# EAGLE design backplane (EAGLE 9.6.2)
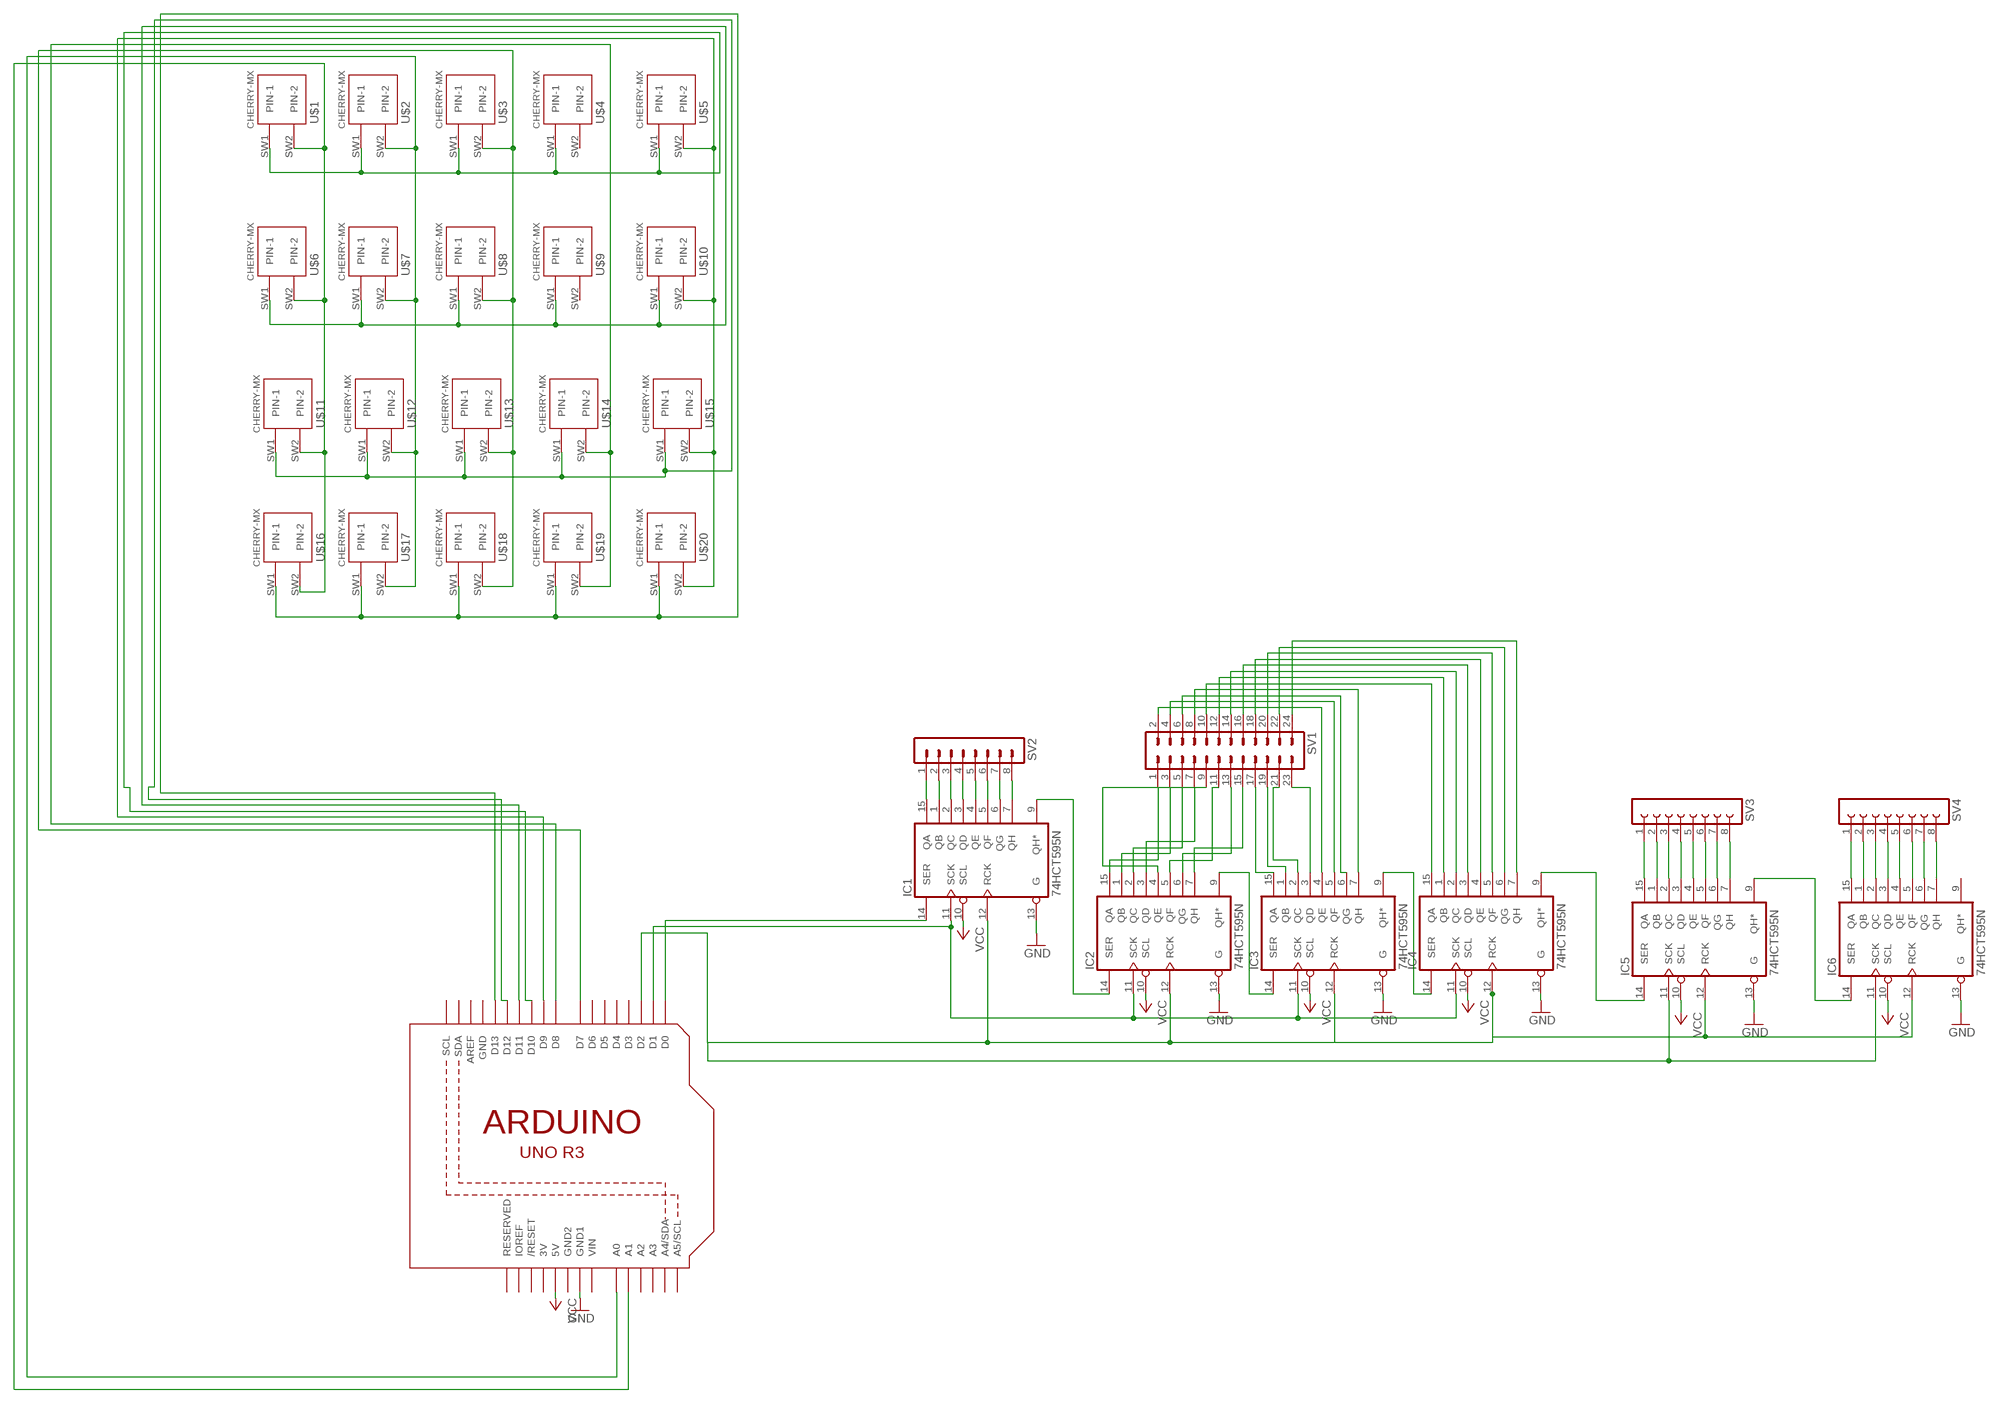
[diagram p0: schematic, sheet 1]

## Parts
IC1  74HCT595N  [DIL16]
IC2  74HCT595N  [DIL16]
IC3  74HCT595N  [DIL16]
IC4  74HCT595N  [DIL16]
IC5  74HCT595N  [DIL16]
IC6  74HCT595N  [DIL16]
SV1  MA12-2  [MA12-2]
SV2  MA08-1  [MA08-1]
SV3  FE08-1  [FE08]
SV4  FE08-1  [FE08]
U1  ARDUINOR3-BPLACE  [ARDUINOR3-BPLACE]
U$1  CHERRY-MX  [CHERRY-MX]
U$2  CHERRY-MX  [CHERRY-MX]
U$3  CHERRY-MX  [CHERRY-MX]
U$4  CHERRY-MX  [CHERRY-MX]
U$5  CHERRY-MX  [CHERRY-MX]
U$6  CHERRY-MX  [CHERRY-MX]
U$7  CHERRY-MX  [CHERRY-MX]
U$8  CHERRY-MX  [CHERRY-MX]
U$9  CHERRY-MX  [CHERRY-MX]
U$10  CHERRY-MX  [CHERRY-MX]
U$11  CHERRY-MX  [CHERRY-MX]
U$12  CHERRY-MX  [CHERRY-MX]
U$13  CHERRY-MX  [CHERRY-MX]
U$14  CHERRY-MX  [CHERRY-MX]
U$15  CHERRY-MX  [CHERRY-MX]
U$16  CHERRY-MX  [CHERRY-MX]
U$17  CHERRY-MX  [CHERRY-MX]
U$18  CHERRY-MX  [CHERRY-MX]
U$19  CHERRY-MX  [CHERRY-MX]
U$20  CHERRY-MX  [CHERRY-MX]

## Nets
GND: IC1.13(G) IC2.13(G) IC3.13(G) IC4.13(G) IC5.13(G) IC6.13(G) U1.GND1
N$1: U1.D10 U$1.SW1(PIN-1) U$2.SW1(PIN-1) U$3.SW1(PIN-1) U$4.SW1(PIN-1) U$5.SW1(PIN-1)
N$2: U1.D11 U$6.SW1(PIN-1) U$7.SW1(PIN-1) U$8.SW1(PIN-1) U$9.SW1(PIN-1) U$10.SW1(PIN-1)
N$3: U1.D12 U$11.SW1(PIN-1) U$12.SW1(PIN-1) U$13.SW1(PIN-1) U$14.SW1(PIN-1) U$15.SW1(PIN-1)
N$4: U1.A1 U$1.SW2(PIN-2) U$6.SW2(PIN-2) U$11.SW2(PIN-2) U$16.SW2(PIN-2)
N$5: U1.A0 U$2.SW2(PIN-2) U$7.SW2(PIN-2) U$12.SW2(PIN-2) U$17.SW2(PIN-2)
N$6: U1.D7 U$3.SW2(PIN-2) U$8.SW2(PIN-2) U$13.SW2(PIN-2) U$18.SW2(PIN-2)
N$7: U1.D8 U$14.SW2(PIN-2) U$19.SW2(PIN-2)
N$8: U1.D9 U$5.SW2(PIN-2) U$10.SW2(PIN-2) U$15.SW2(PIN-2) U$20.SW2(PIN-2)
N$9: IC3.5(QF) SV1.4
N$10: U1.D13 U$16.SW1(PIN-1) U$17.SW1(PIN-1) U$18.SW1(PIN-1) U$19.SW1(PIN-1) U$20.SW1(PIN-1)
N$11: IC3.6(QG) SV1.6
N$12: IC3.7(QH) SV1.8
N$13: IC2.15(QA) SV1.1
N$14: IC2.1(QB) SV1.3
N$15: IC2.2(QC) SV1.5
N$16: IC2.3(QD) SV1.7
N$17: IC2.4(QE) SV1.9
N$18: IC2.5(QF) SV1.11
N$19: IC2.6(QG) SV1.13
N$20: IC2.7(QH) SV1.15
N$21: IC3.15(QA) SV1.17
N$22: IC3.1(QB) SV1.19
N$23: IC3.2(QC) SV1.21
N$24: IC3.3(QD) SV1.23
N$25: IC3.4(QE) SV1.2
N$26: IC4.15(QA) SV1.10
N$27: IC4.1(QB) SV1.12
N$28: IC4.2(QC) SV1.14
N$29: IC4.3(QD) SV1.16
N$30: IC4.4(QE) SV1.18
N$31: IC4.5(QF) SV1.20
N$32: IC4.6(QG) SV1.22
N$33: IC4.7(QH) SV1.24
N$34: IC1.15(QA) SV2.1
N$35: IC1.1(QB) SV2.2
N$36: IC1.2(QC) SV2.3
N$37: IC1.3(QD) SV2.4
N$38: IC1.4(QE) SV2.5
N$39: IC1.5(QF) SV2.6
N$40: IC1.6(QG) SV2.7
N$41: IC1.7(QH) SV2.8
N$42: IC1.9(QH*) IC2.14(SER)
N$43: IC2.9(QH*) IC3.14(SER)
N$44: IC3.9(QH*) IC4.14(SER)
N$45: IC1.14(SER) U1.D0
N$46: IC1.11(SCK) IC2.11(SCK) IC3.11(SCK) IC4.11(SCK) U1.D1
N$47: IC5.15(QA) SV3.1
N$48: IC1.12(RCK) IC2.12(RCK) IC3.12(RCK) IC4.12(RCK) IC5.11(SCK) IC5.12(RCK) IC6.11(SCK) IC6.12(RCK) U1.D2
N$49: IC5.1(QB) SV3.2
N$50: IC5.2(QC) SV3.3
N$51: IC5.3(QD) SV3.4
N$52: IC5.4(QE) SV3.5
N$53: IC5.5(QF) SV3.6
N$54: IC5.6(QG) SV3.7
N$55: IC5.7(QH) SV3.8
N$56: IC6.15(QA) SV4.1
N$57: IC6.1(QB) SV4.2
N$58: IC6.2(QC) SV4.3
N$59: IC6.3(QD) SV4.4
N$60: IC6.4(QE) SV4.5
N$61: IC6.5(QF) SV4.6
N$62: IC6.6(QG) SV4.7
N$63: IC6.7(QH) SV4.8
N$64: IC5.9(QH*) IC6.14(SER)
N$65: IC4.9(QH*) IC5.14(SER)
VCC: IC1.10(SCL) IC2.10(SCL) IC3.10(SCL) IC4.10(SCL) IC5.10(SCL) IC6.10(SCL) U1.5V
Unconnected: IC6.9(QH*) U1.A2 U1.A3 U1.A4(A4/SDA) U1.A5(A5/SCL) U1.AREF U1.D3 U1.D4 U1.D5 U1.D6 U1.IOREF U1.RESERVED U1.RESET(/RESET) U1.SCL U1.SDA U$4.SW2(PIN-2) U$9.SW2(PIN-2)

## Power pins joined to a net without a drawn wire
3V: U1.3V
GND: IC1.8(GND) IC2.8(GND) IC3.8(GND) IC4.8(GND) IC5.8(GND) IC6.8(GND) U1.GND
GND2: U1.GND2
VCC: IC1.16(VCC) IC2.16(VCC) IC3.16(VCC) IC4.16(VCC) IC5.16(VCC) IC6.16(VCC)
VIN: U1.VIN

## Library data of the parts
IC1-IC6 = 74xx-eu:74*595: 8-bit SHIFT REGISTER, output latch
SV1 = con-lstb:MA12-2: PIN HEADER; OC_FARNELL: unknown; OC_NEWARK: unknown
SV2 = con-lstb:MA08-1: PIN HEADER; OC_FARNELL: unknown; OC_NEWARK: unknown
SV3 SV4 = con-lsta:FE08-1: FEMALE HEADER; OC_FARNELL: unknown; OC_NEWARK: unknown
U1 = adafruit:ARDUINOR3: This is a new object for the new Arduino R3 - with extra pins that you may want to use (such as IOref, and duplicated A4/A5
U$1-U$20 = cherrymx:CHERRY-MX: Cherry MX series keyswitch

## Board
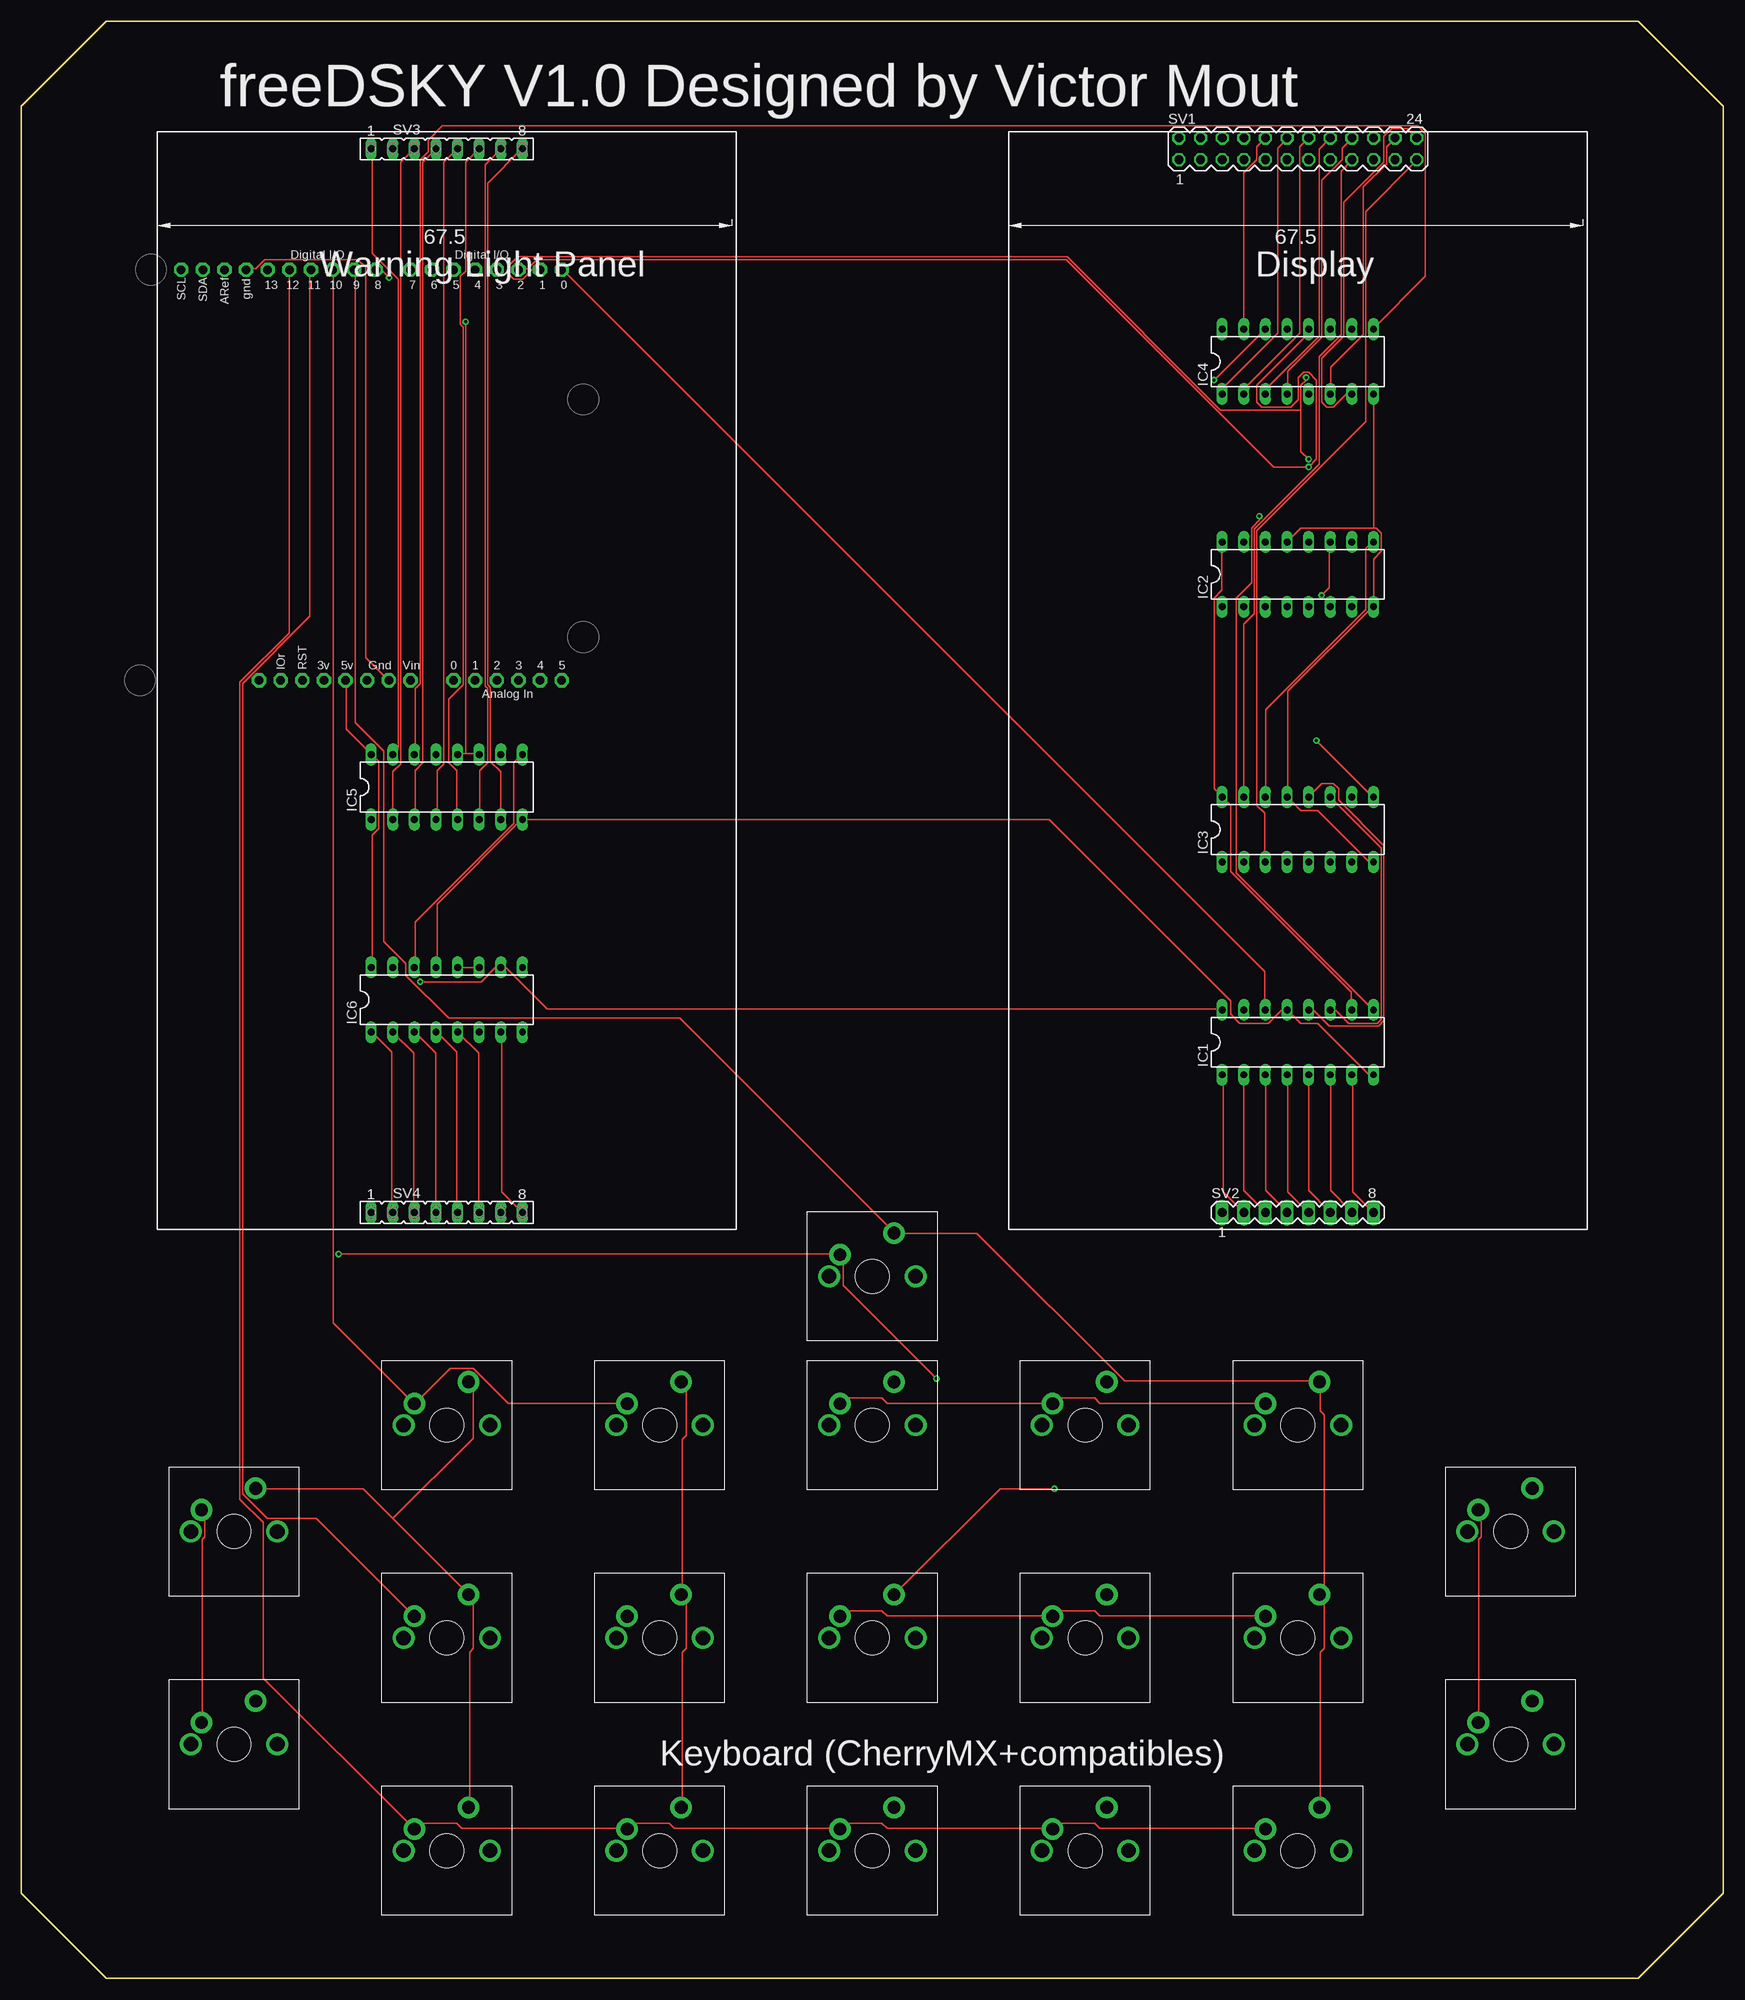
[diagram p1: board, top side]
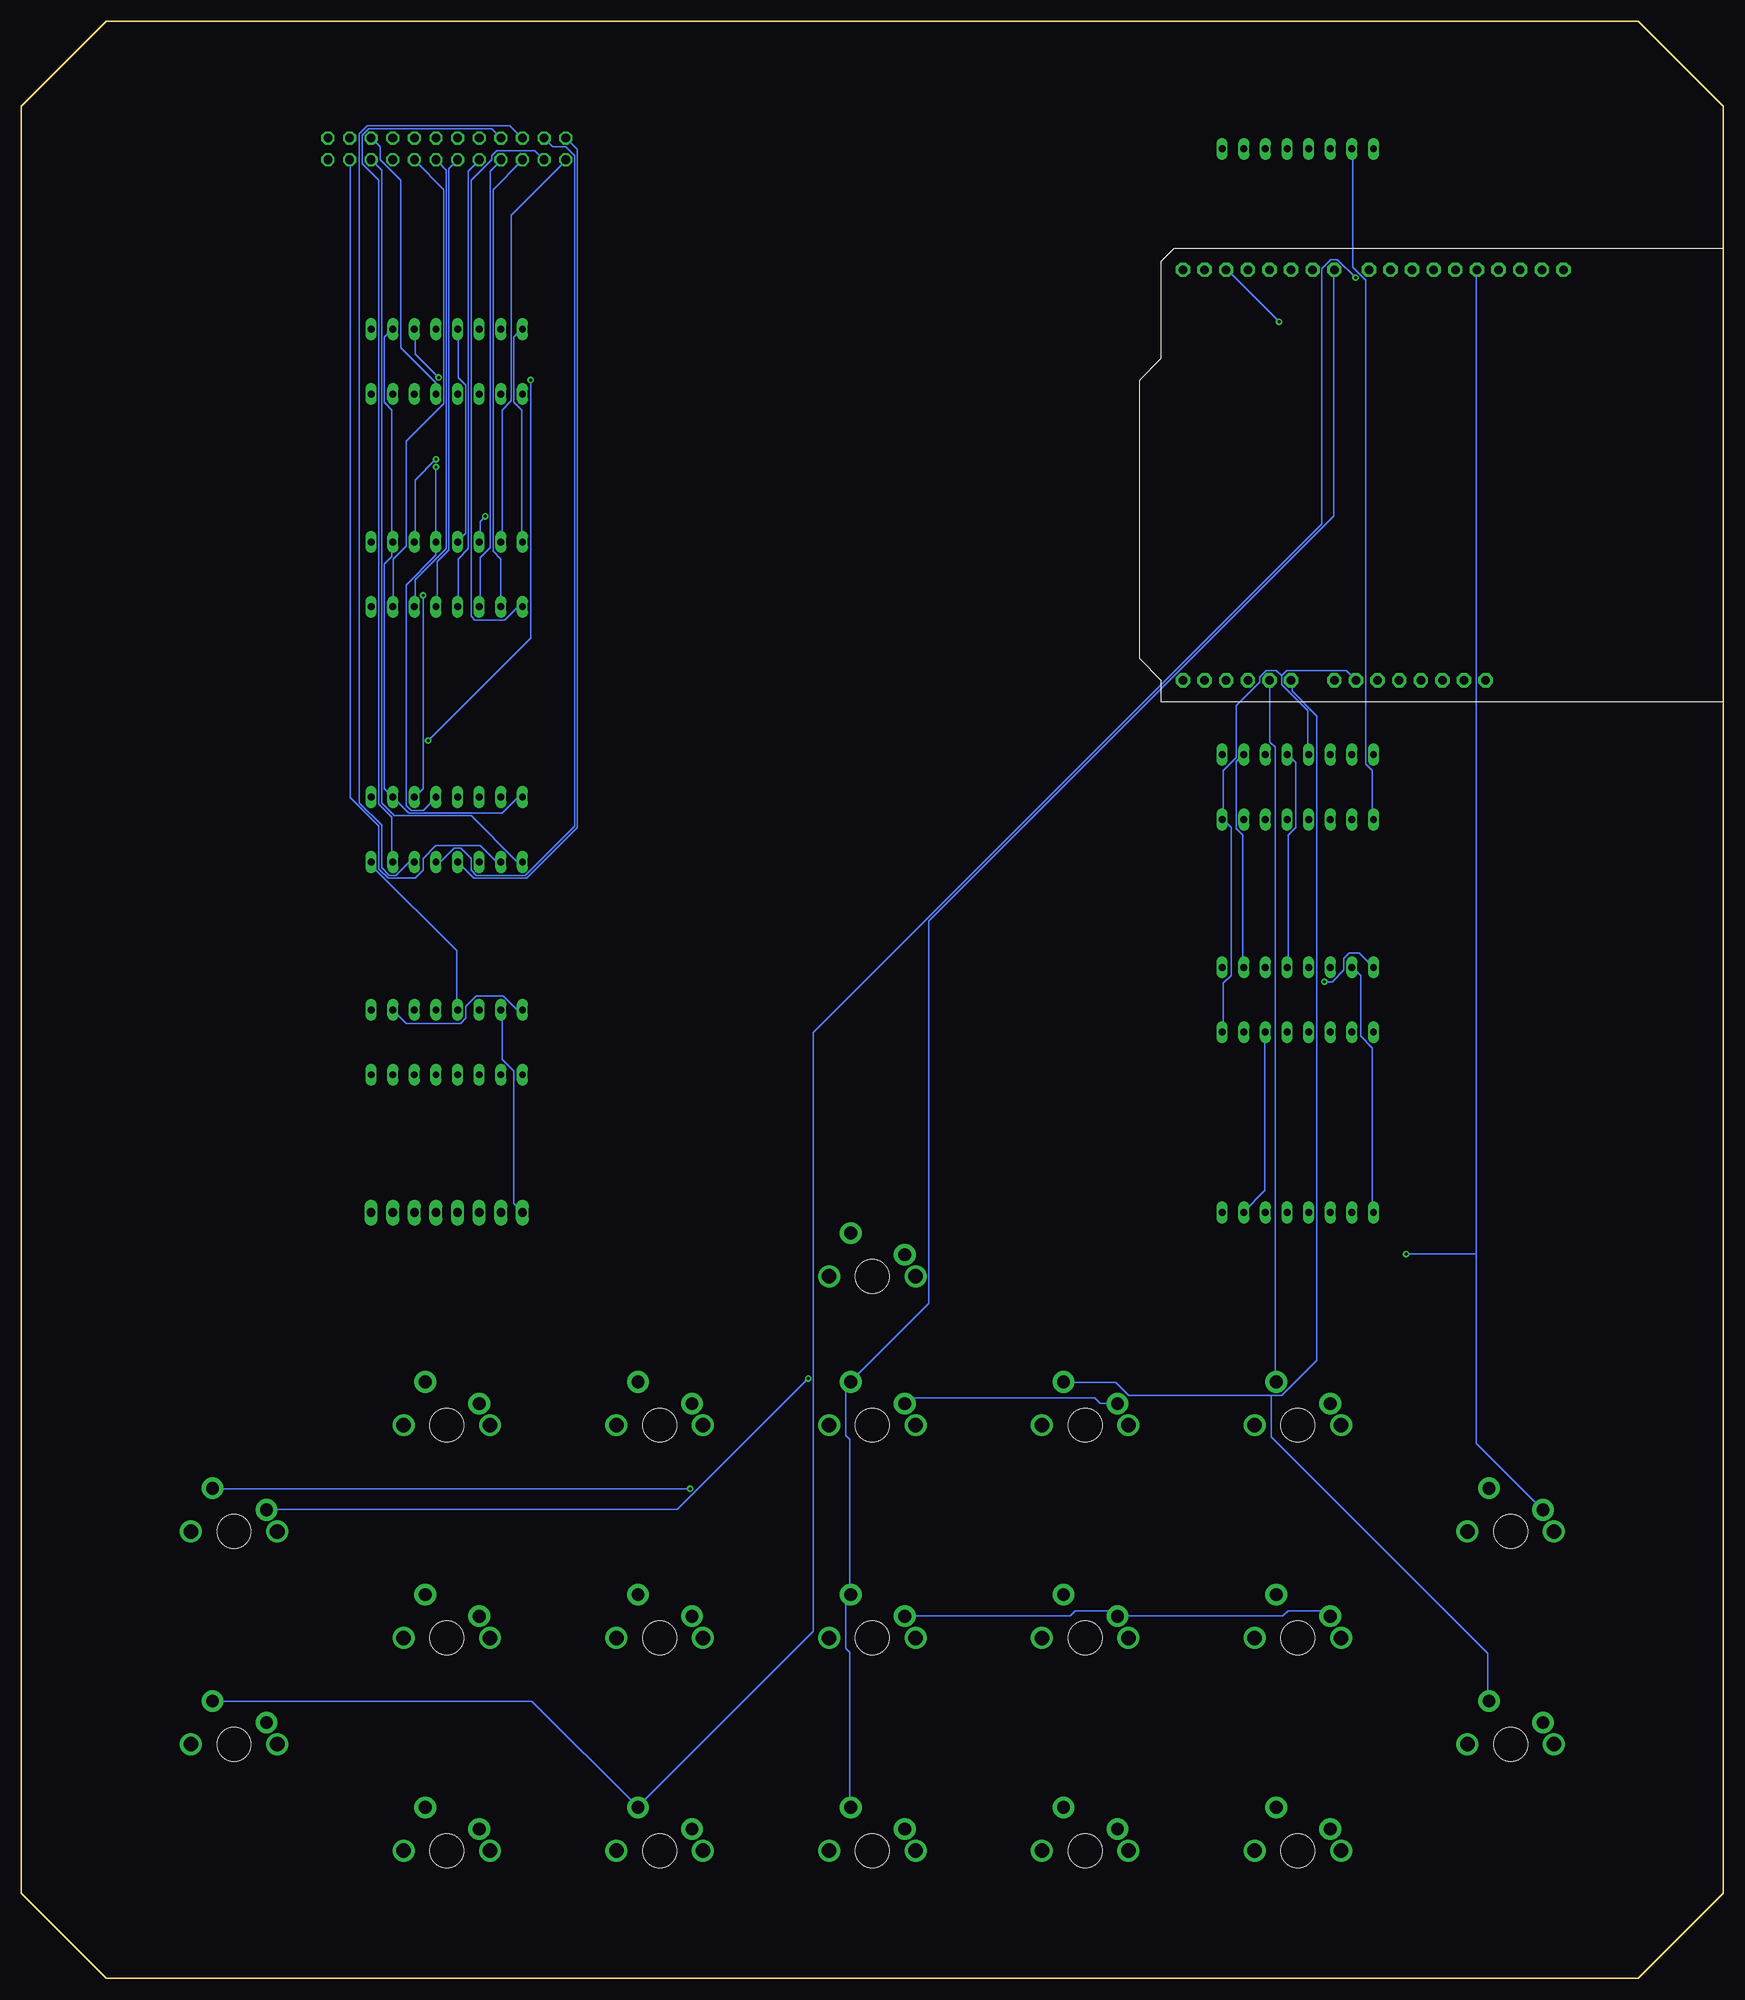
[diagram p2: board, bottom side, seen from below]

Size 200 x 230 mm. Coordinates in mm from the lower left corner, seen from the top.
Outline: 10,0 190,0 200,10 200,220 190,230 10,230 0,220 0,10 10,0
Copper layers (1*16): Top 0.035mm / dielectric 1.5mm / Bottom 0.035mm
Design rules "default": minimum track width 6mil, minimum drill 0.35mm, track to track 6mil, track to pad 6mil, pad to pad 6mil, via to via 6mil, smd to smd 6mil, copper to edge 40mil, drill to drill 6mil, minimum pad ring 10mil, minimum via ring 8mil, stop-mask expansion 4mil, vias tented up to drill 0mil, thermal gap 10mil

### Footprints (pad centres in the part's own frame; a part is rotated, then mirrored left to right if it is on the bottom)
DIL16 = drill 0.813 long: 1 -8.89,-3.81; 2 -6.35,-3.81; 3 -3.81,-3.81; 4 -1.27,-3.81; 5 1.27,-3.81; 6 3.81,-3.81; 7 6.35,-3.81; 8 8.89,-3.81; 9 8.89,3.81; 10 6.35,3.81; 11 3.81,3.81; 12 1.27,3.81; 13 -1.27,3.81; 14 -3.81,3.81; 15 -6.35,3.81; 16 -8.89,3.81
MA12-2 = drill 1.016 octagon: 1 -13.97,-1.27; 2 -13.97,1.27; 3 -11.43,-1.27; 4 -11.43,1.27; 5 -8.89,-1.27; 6 -8.89,1.27; 7 -6.35,-1.27; 8 -6.35,1.27; 9 -3.81,-1.27; 10 -3.81,1.27; 11 -1.27,-1.27; 12 -1.27,1.27; 13 1.27,-1.27; 14 1.27,1.27; 15 3.81,-1.27; 16 3.81,1.27; 17 6.35,-1.27; 18 6.35,1.27; 19 8.89,-1.27; 20 8.89,1.27; 21 11.43,-1.27; 22 11.43,1.27; 23 13.97,-1.27; 24 13.97,1.27
MA08-1 = drill 1.016 long: 1 -8.89,0; 2 -6.35,0; 3 -3.81,0; 4 -1.27,0; 5 1.27,0; 6 3.81,0; 7 6.35,0; 8 8.89,0
FE08 = drill 0.813 long: 1 -8.89,0; 2 -6.35,0; 3 -3.81,0; 4 -1.27,0; 5 1.27,0; 6 3.81,0; 7 6.35,0; 8 8.89,0
ARDUINOR3-BPLACE = drill 1 pad 1.676 octagon: 3V 35.56,2.54; 5V 38.1,2.54; A0 50.8,2.54; A1 53.34,2.54; A2 55.88,2.54; A3 58.42,2.54; A4 60.96,2.54; A5 63.5,2.54; AREF 23.876,50.8; D0 63.5,50.8; D1 60.96,50.8; D2 58.42,50.8; D3 55.88,50.8; D4 53.34,50.8; D5 50.8,50.8; D6 48.26,50.8; D7 45.72,50.8; D8 41.656,50.8; D9 39.116,50.8; D10 36.576,50.8; D11 34.036,50.8; D12 31.496,50.8; D13 28.956,50.8; GND 26.416,50.8; GND1 43.18,2.54; GND2 40.64,2.54; IOREF 30.48,2.54; RESERVED 27.94,2.54; RESET 33.02,2.54; SCL 18.796,50.8; SDA 21.336,50.8; VIN 45.72,2.54
CHERRY-MX = drill 1.714 pad 1.93: P$3 -5.08,0; P$4 5.08,0 | drill 1.5 pad 2.54: SW1 -3.81,2.54; SW2 2.54,5.08 | hole 4: 0,0

### Placement (x,y rotation side)
IC1  150,110 0 top
IC2  150,165 0 top
IC3  150,135 0 top
IC4  150,190 0 top
IC5  50,140 0 top
IC6  50,115 0 top
SV1  150,215 0 top
SV2  150,90 0 top
SV3  50,215 0 top
SV4  50,90 0 top
U1  0,150 0 top
U$1  50,65 0 top
U$2  75,65 0 top
U$3  100,65 0 top
U$4  125,65 0 top
U$5  150,65 0 top
U$6  50,40 0 top
U$7  75,40 0 top
U$8  100,40 0 top
U$9  125,40 0 top
U$10  150,40 0 top
U$11  50,15 0 top
U$12  75,15 0 top
U$13  100,15 0 top
U$14  125,15 0 top
U$15  150,15 0 top
U$16  25,52.5 0 top
U$17  25,27.5 0 top
U$18  175,52.5 0 top
U$19  175,27.5 0 top
U$20  100,82.5 0 top

### Tracks (layer width: path | path; a pad name or v marks a point on that pad's centre or on a via)
GND
  Top 0.152: IC1.8 158.74,106.29 158.28,106.29 152.34,112.24 150.36,112.24 148.83,113.76 IC1.13 148.68,113.76 148.07,113.76 146.55,112.24 143.19,112.24 142.13,113.3 142.13,114.83 120.79,136.16 58.92,136.16 IC5.8 58.76,136.16 48.86,126.26 48.86,118.94 IC6.13 | IC3.8 158.74,131.29 158.28,131.29 152.34,137.23 150.36,137.23 148.83,138.75 IC3.13 148.83,138.91 148.83,151.25 158.74,161.16 IC2.8 158.89,161.31 158.89,166.8 159.81,167.71 159.81,169.84 159.2,170.45 158.89,170.45 | 158.89,170.45 150.36,170.45 148.83,168.93 IC2.13 | 158.89,170.45 158.89,186.15 IC4.8 | U1.GND 26.46,200.93 27.52,200.93 28.59,202 39.56,202 40.48,201.09 40.48,155.21 43.07,152.62 U1.GND1
  Bottom 0.152: IC1.13 148.83,113.91 148.83,120.77 158.74,130.68 158.74,131.13 IC3.8 | IC4.13 148.68,193.77 148.68,188.13 147.77,187.22 147.77,169.84 148.68,168.93 IC2.13 | IC6.8 58.76,111.32 58.76,116.96 57.85,117.88 57.85,135.25 58.76,136.16 IC5.8 58.76,136.32 58.76,141.96 57.24,143.48 57.24,149.58 54.5,152.32 54.5,152.93 53.73,153.69 52.52,153.69 51.91,153.08 | 51.91,153.08 51.91,152.01 48.86,148.97 48.86,143.94 IC5.13 | 51.91,153.08 51.3,153.69 44.29,153.69 43.22,152.62 U1.GND1
N$1
  Top 0.152: U$3.SW1 96.25,67.58 96.86,68.19 101.13,68.19 101.74,67.58 121.1,67.58 U$4.SW1 121.25,67.58 121.86,68.19 126.12,68.19 126.73,67.58 146.09,67.58 U$5.SW1 | U1.D10 36.67,200.78 36.67,77.03 46.11,67.58 U$1.SW1 46.27,67.58 50.38,71.7 53.13,71.7 57.24,67.58 71.11,67.58 U$2.SW1
  Bottom 0.152: U$2.SW1 71.26,67.58 73.24,67.58 73.85,68.19 95.49,68.19 96.1,67.58 U$3.SW1
N$2
  Top 0.152: U1.D11 33.92,200.78 33.92,160.09 26,152.17 26,56.92 28.89,54.02 34.69,54.02 46.11,42.59 U$6.SW1 | U$8.SW1 96.25,42.59 96.86,43.2 101.13,43.2 101.74,42.59 121.1,42.59 U$9.SW1 121.25,42.59 121.86,43.2 126.12,43.2 126.73,42.59 146.09,42.59 U$10.SW1
  Bottom 0.152: U$6.SW1 46.27,42.59 46.88,43.2 51.14,43.2 51.75,42.59 71.11,42.59 U$7.SW1 71.26,42.59 71.87,43.2 76.14,43.2 76.75,42.59 96.1,42.59 U$8.SW1
N$3
  Top 0.152: U1.D12 31.48,200.78 31.48,158.11 25.69,152.32 25.69,56.31 28.44,53.56 28.44,35.28 46.11,17.6 U$11.SW1 46.27,17.6 46.88,18.21 51.14,18.21 51.75,17.6 71.11,17.6 U$12.SW1 71.26,17.6 71.87,18.21 76.14,18.21 76.75,17.6 96.1,17.6 U$13.SW1 96.25,17.6 96.86,18.21 101.13,18.21 101.74,17.6 121.1,17.6 U$14.SW1 121.25,17.6 121.86,18.21 126.12,18.21 126.73,17.6 146.09,17.6 U$15.SW1
N$4
  Top 0.152: U$11.SW2 52.67,20.19 52.67,38.32 53.13,38.78 53.13,44.57 52.67,45.03 U$6.SW2 52.52,45.18 43.68,54.02 | 43.68,54.02 40.17,57.53 27.67,57.53 U$16.SW2 | 43.68,54.02 53.13,63.47 53.13,69.57 52.67,70.02 U$1.SW2
  Bottom 0.152: U1.A1 53.28,152.47 53.28,145.31 52.67,144.7 52.67,70.17 U$1.SW2
N$5
  Top 0.152: U$12.SW2 77.66,20.19 77.66,38.32 78.12,38.78 78.12,44.57 77.66,45.03 U$7.SW2 77.66,45.18 77.66,63.32 78.12,63.77 78.12,69.57 77.66,70.02 U$2.SW2
  Bottom 0.152: 53.13,68.5 69.89,68.5 71.41,70.02 77.51,70.02 U$2.SW2 | 53.13,68.5 51.91,68.5 47.79,72.61 47.79,148.36 50.69,151.25 50.69,152.47 U1.A0 | 53.13,68.5 53.13,63.62 27.67,38.17 27.67,32.69 U$17.SW2
N$6  (via drill 0.35)
  Top 0.152: v121.4,57.53 115,57.53 102.66,45.18 U$8.SW2
  Bottom 0.152: U$13.SW2 102.66,20.19 102.66,38.32 103.11,38.78 103.11,44.57 102.66,45.03 U$8.SW2 102.66,45.18 102.66,63.32 103.11,63.77 103.11,69.57 102.66,70.02 U$3.SW2 102.5,70.17 93.36,79.32 93.36,124.28 45.81,171.83 45.81,200.78 U1.D7 | v121.4,57.53 177.48,57.53 U$18.SW2
N$7  (via drill 0.35)
  Top 0.152: v43.22,199.87 42.31,200.78 41.7,200.78 U1.D8
  Bottom 0.152: v43.22,199.87 45.35,202 46.11,202 47.18,200.93 47.18,170.91 106.92,111.17 106.92,40.76 127.5,20.19 U$14.SW2 127.65,20.19 139.99,32.53 177.48,32.53 U$19.SW2
N$8
  Top 0.152: U$15.SW2 152.64,20.19 152.64,38.32 153.1,38.78 153.1,44.57 152.64,45.03 U$10.SW2 152.64,45.18 153.1,45.64 153.1,66.21 152.64,66.67 152.64,70.02 U$5.SW2 152.49,70.17 129.63,70.17 112.26,87.55 102.66,87.55 U$20.SW2 102.5,87.7 77.36,112.85 50.23,112.85 45.2,117.88 45.2,119.25 42.61,121.84 42.61,144.24 39.26,147.59 39.26,200.78 U1.D9
N$9
  Bottom 0.152: IC3.5 151.12,131.29 150.66,131.29 149.14,132.81 148.38,132.81 147.16,131.59 147.16,130.22 146.55,129.61 140.76,129.61 134.96,135.4 134.96,214.19 136.03,215.26 137.56,215.26 138.47,216.17 SV1.4
N$10  (via drill 0.35)
  Top 0.152: U$19.SW1 171.24,30.09 171.24,51.58 171.54,51.89 171.54,54.63 171.24,54.94 U$18.SW1 | U$17.SW1 21.27,30.09 21.27,51.58 21.58,51.89 21.58,54.63 21.27,54.94 U$16.SW1 | v37.28,85.11 96.1,85.11 U$20.SW1 96.25,84.96 96.56,84.65 96.56,81.45 v107.53,70.48
  Bottom 0.152: 29.05,85.11 29.05,62.86 21.27,55.09 U$16.SW1 | 29.05,85.11 29.05,200.78 U1.D13 | 29.05,85.11 v37.28,85.11 | v107.53,70.48 122.92,55.09 171.08,55.09 U$18.SW1
N$11
  Bottom 0.152: IC3.6 153.86,131.13 154.47,131.13 156,129.61 156.76,129.61 157.67,130.53 157.67,135.56 160.26,138.15 160.26,216.78 159.35,217.7 142.58,217.7 141.21,216.33 SV1.6
N$12
  Bottom 0.152: IC3.7 156.45,131.29 156.45,136.47 157.98,137.99 157.98,211.3 159.96,213.28 159.96,216.63 159.2,217.39 144.72,217.39 143.65,216.33 SV1.8
N$13
  Bottom 0.152: IC2.15 143.5,168.93 143.5,184.32 142.43,185.39 142.43,207.18 136.03,213.58 SV1.1
N$14
  Bottom 0.152: IC2.1 141.21,161.16 141.67,161.16 143.19,159.63 146.7,159.63 147.16,160.09 147.16,211.3 144.72,213.74 144.72,214.19 144.11,214.8 139.69,214.8 138.62,213.74 SV1.3
N$15
  Bottom 0.152: IC2.2 143.65,161.31 143.65,166.8 144.57,167.71 144.57,210.23 141.21,213.58 SV1.5
N$16
  Bottom 0.152: IC2.3 146.09,161.31 146.09,166.95 144.87,168.17 144.87,212.36 143.65,213.58 SV1.7
N$17
  Bottom 0.152: IC2.4 148.68,161.31 148.68,166.8 147.46,168.02 147.46,212.36 146.24,213.58 SV1.9
N$18
  Bottom 0.152: IC2.5 151.12,161.31 151.12,166.49 149.75,167.86 149.75,212.67 148.83,213.58 SV1.11
N$19
  Bottom 0.152: IC2.6 153.71,161.31 153.71,164.36 150.05,168.02 150.05,212.52 151.12,213.58 SV1.13
N$20
  Bottom 0.152: IC2.7 156.3,161.31 156.3,166.8 154.78,168.32 154.78,180.66 150.36,185.09 150.36,210.23 153.71,213.58 SV1.15
N$21
  Top 0.152: IC3.15 143.65,138.91 143.65,159.18 144.87,160.4 144.87,170.3 152.49,177.92 152.49,190.57 155.08,193.16 155.08,212.36 156.3,213.58 SV1.17
N$22
  Bottom 0.152: IC3.1 141.21,131.29 141.82,131.29 147.16,136.62 156.15,136.62 157.67,138.15 157.67,212.52 158.74,213.58 SV1.19
N$23
  Bottom 0.152: IC3.2 143.65,131.29 144.26,131.29 146.09,133.12 151.27,133.12 152.8,131.59 152.8,130.22 153.71,129.31 156.91,129.31 157.98,130.37 157.98,135.4 161.33,138.75 161.33,213.58 SV1.21
N$24
  Top 0.152: IC3.3 146.09,131.29 146.09,136.93 145.18,137.84 145.18,170.15 157.98,182.95 157.98,207.64 163.92,213.58 SV1.23
N$25
  Bottom 0.152: IC3.4 148.68,131.13 146.85,129.31 140.6,129.31 134.66,135.25 134.66,214.96 135.88,216.17 SV1.2
N$26
  Top 0.152: IC4.15 143.65,193.92 143.65,212.21 145.18,213.74 145.18,215.26 146.09,216.17 SV1.10
N$27
  Top 0.152: IC4.1 141.21,186.3 141.21,186.91 147.61,193.31 147.61,215.11 148.68,216.17 SV1.12
N$28
  Top 0.152: IC4.2 143.65,186.3 143.65,186.76 150.2,193.31 150.2,215.26 151.12,216.17 SV1.14
N$29
  Top 0.152: IC4.3 146.24,186.3 146.24,186.76 152.49,193.01 152.49,214.96 153.71,216.17 SV1.16
N$30
  Top 0.152: IC4.4 148.83,186.3 148.83,188.9 152.8,192.86 152.8,211.3 155.23,213.74 155.23,215.11 156.3,216.17 SV1.18
N$31
  Bottom 0.152: IC4.5 151.27,186.3 151.27,187.52 155.39,191.64 155.39,211.3 157.82,213.74 157.82,215.26 158.74,216.17 SV1.20
N$32
  Top 0.152: IC4.6 153.86,186.3 153.86,189.35 157.67,193.16 157.67,210.54 160.41,213.28 160.41,215.26 161.33,216.17 SV1.22
N$33
  Top 0.152: IC4.7 156.3,186.15 155.69,186.15 154.17,184.63 153.41,184.63 152.8,185.24 152.8,190.42 155.39,193.01 155.39,208.71 160.11,213.43 160.11,216.48 161.03,217.39 162.85,217.39 163.92,216.33 SV1.24
N$34
  Bottom 0.152: IC1.15 143.5,113.76 143.5,107.97 142.13,106.6 142.13,91.05 141.21,90.14 SV2.1
N$35
  Top 0.152: IC1.1 141.21,106.14 141.21,92.43 143.5,90.14 SV2.2
N$36
  Top 0.152: IC1.2 143.65,106.14 143.65,92.58 146.09,90.14 SV2.3
N$37
  Top 0.152: IC1.3 146.24,106.14 146.24,92.58 148.68,90.14 SV2.4
N$38
  Top 0.152: IC1.4 148.83,106.14 148.83,92.43 151.12,90.14 SV2.5
N$39
  Top 0.152: IC1.5 151.27,106.14 151.27,92.58 153.71,90.14 SV2.6
N$40
  Top 0.152: IC1.6 153.86,106.14 153.86,92.58 156.3,90.14 SV2.7
N$41
  Top 0.152: IC1.7 156.45,106.14 156.45,92.43 158.74,90.14 SV2.8
N$42  (via drill 0.35)
  Top 0.152: v145.48,171.83 145.48,171.37 144.57,170.45 144.57,164.05 142.74,162.22 142.74,129.92 158.74,113.91 IC1.9
  Bottom 0.152: v145.48,171.83 146.09,171.22 146.09,168.93 IC2.14
N$43
  Top 0.152: IC3.14 146.24,138.91 146.24,149.12 157.98,160.85 157.98,168.02 158.74,168.78 IC2.9
N$44  (via drill 0.35)
  Top 0.152: v140.15,187.83 146.09,193.77 IC4.14 | v152.19,145.46 158.74,138.91 IC3.9
  Bottom 0.152: v140.15,187.83 140.15,157.5 v152.19,145.46
N$45
  Top 0.152: IC1.14 146.09,113.91 146.09,118.33 63.64,200.78 U1.D0
N$46  (via drill 0.35)
  Top 0.152: IC1.11 153.86,113.76 154.47,113.76 156,112.24 159.35,112.24 159.81,112.69 159.81,132.81 153.86,138.75 IC3.11 | v152.8,162.53 153.71,163.44 153.71,168.78 IC2.11 | v150.97,188.13 150.97,187.83 150.36,187.22 150.36,184.32 | 150.36,184.32 150.36,179.45 v151.27,178.53 | 150.36,184.32 140.91,184.32 122.92,202.31 58.31,202.31 57.24,201.24 57.24,200.32 57.85,199.72 58.92,199.72 59.98,200.78 60.9,200.78 U1.D1
  Bottom 0.152: v152.8,162.53 152.8,139.82 153.71,138.91 IC3.11 | v150.97,188.13 153.71,190.88 153.71,193.77 IC4.11 | v151.27,178.53 153.71,176.09 153.71,168.93 IC2.11
N$47
  Top 0.152: SV3.1 41.24,214.96 41.24,202.76 44.29,199.72 44.29,144.55 43.68,143.94 IC5.15
N$48  (via drill 0.35)
  Top 0.152: IC6.12 51.3,118.79 53.73,118.79 IC6.11 | 52.21,143.94 53.73,143.94 IC5.11 | 52.21,143.94 51.3,143.94 IC5.12 | 52.21,143.94 v52.21,194.69 | IC1.12 151.27,113.76 151.88,113.76 153.71,111.93 159.5,111.93 160.11,112.54 160.11,133.12 154.78,138.45 154.78,139.82 154.17,140.43 152.8,140.43 151.27,138.91 IC3.12 | IC4.12 151.12,193.77 151.12,193.16 145.18,187.22 145.18,185.24 145.78,184.63 149.14,184.63 150.05,185.54 150.05,188.13 150.66,188.74 151.27,188.74 152.19,187.83 152.19,178.53 v151.27,177.62 147.16,177.62 122.77,202 60.59,202 59.53,200.93 58.46,200.93 U1.D2
  Bottom 0.152: v52.21,194.69 58.31,200.78 U1.D2 | IC6.12 51.14,118.94 51.14,134.34 50.23,135.25 50.23,142.87 51.14,143.78 IC5.12 | IC3.12 151.27,138.75 152.8,137.23 154.17,137.23 154.78,137.84 154.78,163.75 151.27,167.25 151.27,168.78 IC2.12 151.27,168.93 v151.27,177.62
N$49
  Bottom 0.152: IC5.1 41.24,136.32 41.24,141.96 42,142.72 42,199.56 43.52,201.09 43.52,214.96 SV3.2
N$50
  Top 0.152: IC5.2 43.68,136.32 43.68,141.8 44.59,142.72 44.59,213.43 46.11,214.96 SV3.3
N$51
  Top 0.152: IC5.3 46.27,136.32 46.27,141.96 47.18,142.87 47.18,213.43 48.71,214.96 SV3.4
N$52
  Top 0.152: IC5.4 48.86,136.32 48.86,141.96 49.62,142.72 49.62,213.43 51.14,214.96 SV3.5
N$53
  Top 0.152: IC5.5 51.14,136.32 51.14,141.96 50.23,142.87 50.23,150.34 51.91,152.01 51.91,194.08 51.6,194.38 51.6,200.02 52.21,200.63 52.21,213.43 53.73,214.96 SV3.6
N$54
  Top 0.152: IC5.6 53.89,136.32 53.89,141.96 54.8,142.87 54.8,151.56 54.5,151.86 54.5,213.13 56.33,214.96 SV3.7
N$55
  Top 0.152: IC5.7 56.33,136.32 56.33,141.8 55.11,143.02 55.11,151.71 54.8,152.01 54.8,210.99 58.76,214.96 SV3.8
N$56
  Bottom 0.152: SV4.1 41.24,90.14 41.24,109.34 42.61,110.71 42.61,117.88 43.52,118.79 IC6.15
N$57
  Top 0.152: SV4.2 43.52,90.14 43.52,108.89 41.24,111.17 IC6.1
N$58
  Top 0.152: SV4.3 46.11,90.14 46.11,108.73 43.68,111.17 IC6.2
N$59
  Top 0.152: SV4.4 48.71,90.14 48.71,108.73 46.27,111.17 IC6.3
N$60
  Top 0.152: SV4.5 51.14,90.14 51.14,108.89 48.86,111.17 IC6.4
N$61
  Top 0.152: SV4.6 53.73,90.14 53.73,108.73 51.3,111.17 IC6.5
N$62
  Bottom 0.152: IC6.6 53.89,111.17 53.89,92.58 56.33,90.14 SV4.7
N$63
  Top 0.152: IC6.7 56.48,111.17 56.48,92.43 58.76,90.14 SV4.8
N$64
  Top 0.152: IC6.14 46.27,118.94 46.27,124.12 57.85,135.71 57.85,142.87 58.76,143.78 IC5.9
N$65
  Top 0.152: IC5.14 46.27,143.94 46.27,151.56 46.88,152.17 46.88,213.74 47.79,214.65 47.79,216.02 49.47,217.7 164.07,217.7 164.99,216.78 164.99,200.02 158.89,193.92 IC4.9
VCC  (via drill 0.35)
  Top 0.152: IC6.16 41.24,118.94 41.24,134.34 42,135.1 42,143.02 41.24,143.78 IC5.16 41.09,143.94 38.19,146.83 38.19,152.47 U1.5V | v46.88,117.11 54.04,117.11 55.72,118.79 56.33,118.79 IC6.10 56.48,118.79 56.94,118.79 61.81,113.91 141.06,113.91 IC1.16 | IC1.10 156.3,113.91 156.3,115.89 142.13,130.07 142.13,137.84 141.21,138.75 IC3.16 141.06,138.91 140.15,139.82 140.15,162.22 141.06,163.14 141.06,168.78 IC2.16
  Bottom 0.152: IC6.10 56.48,118.94 56.48,134.34 57.24,135.1 57.24,143.02 56.48,143.78 IC5.10 | v46.88,117.11 45.96,117.11 44.59,118.49 44.59,119.86 43.98,120.47 42.76,120.47 41.24,118.94 IC6.16 | IC4.10 156.45,193.77 157.37,192.86 157.37,185.24 156.45,184.32 156.45,168.93 IC2.10 156.45,168.78 156.45,167.1 157.37,166.19 157.37,139.82 156.45,138.91 IC3.10 156.3,138.75 154.47,136.93 143.5,136.93 141.67,138.75 141.21,138.75 IC3.16 | IC2.16 141.21,168.93 141.21,184.32 142.13,185.24 142.13,192.86 141.21,193.77 IC4.16 | IC1.16 141.21,113.91 141.82,113.91 143.35,115.44 146.55,115.44 147.77,114.22 147.77,112.85 148.38,112.24 154.78,112.24 156.3,113.76 IC1.10

### Text on the board
tPlace: freeDSKY V1.0 Designed by Victor Mout | Warning Light Panel | Display | Keyboard (CherryMX+compatibles)